# Altium schematic sheet Ethernet_Sheet2.SchDoc
size A3; SheetNumber: 3; SheetTotal: 3
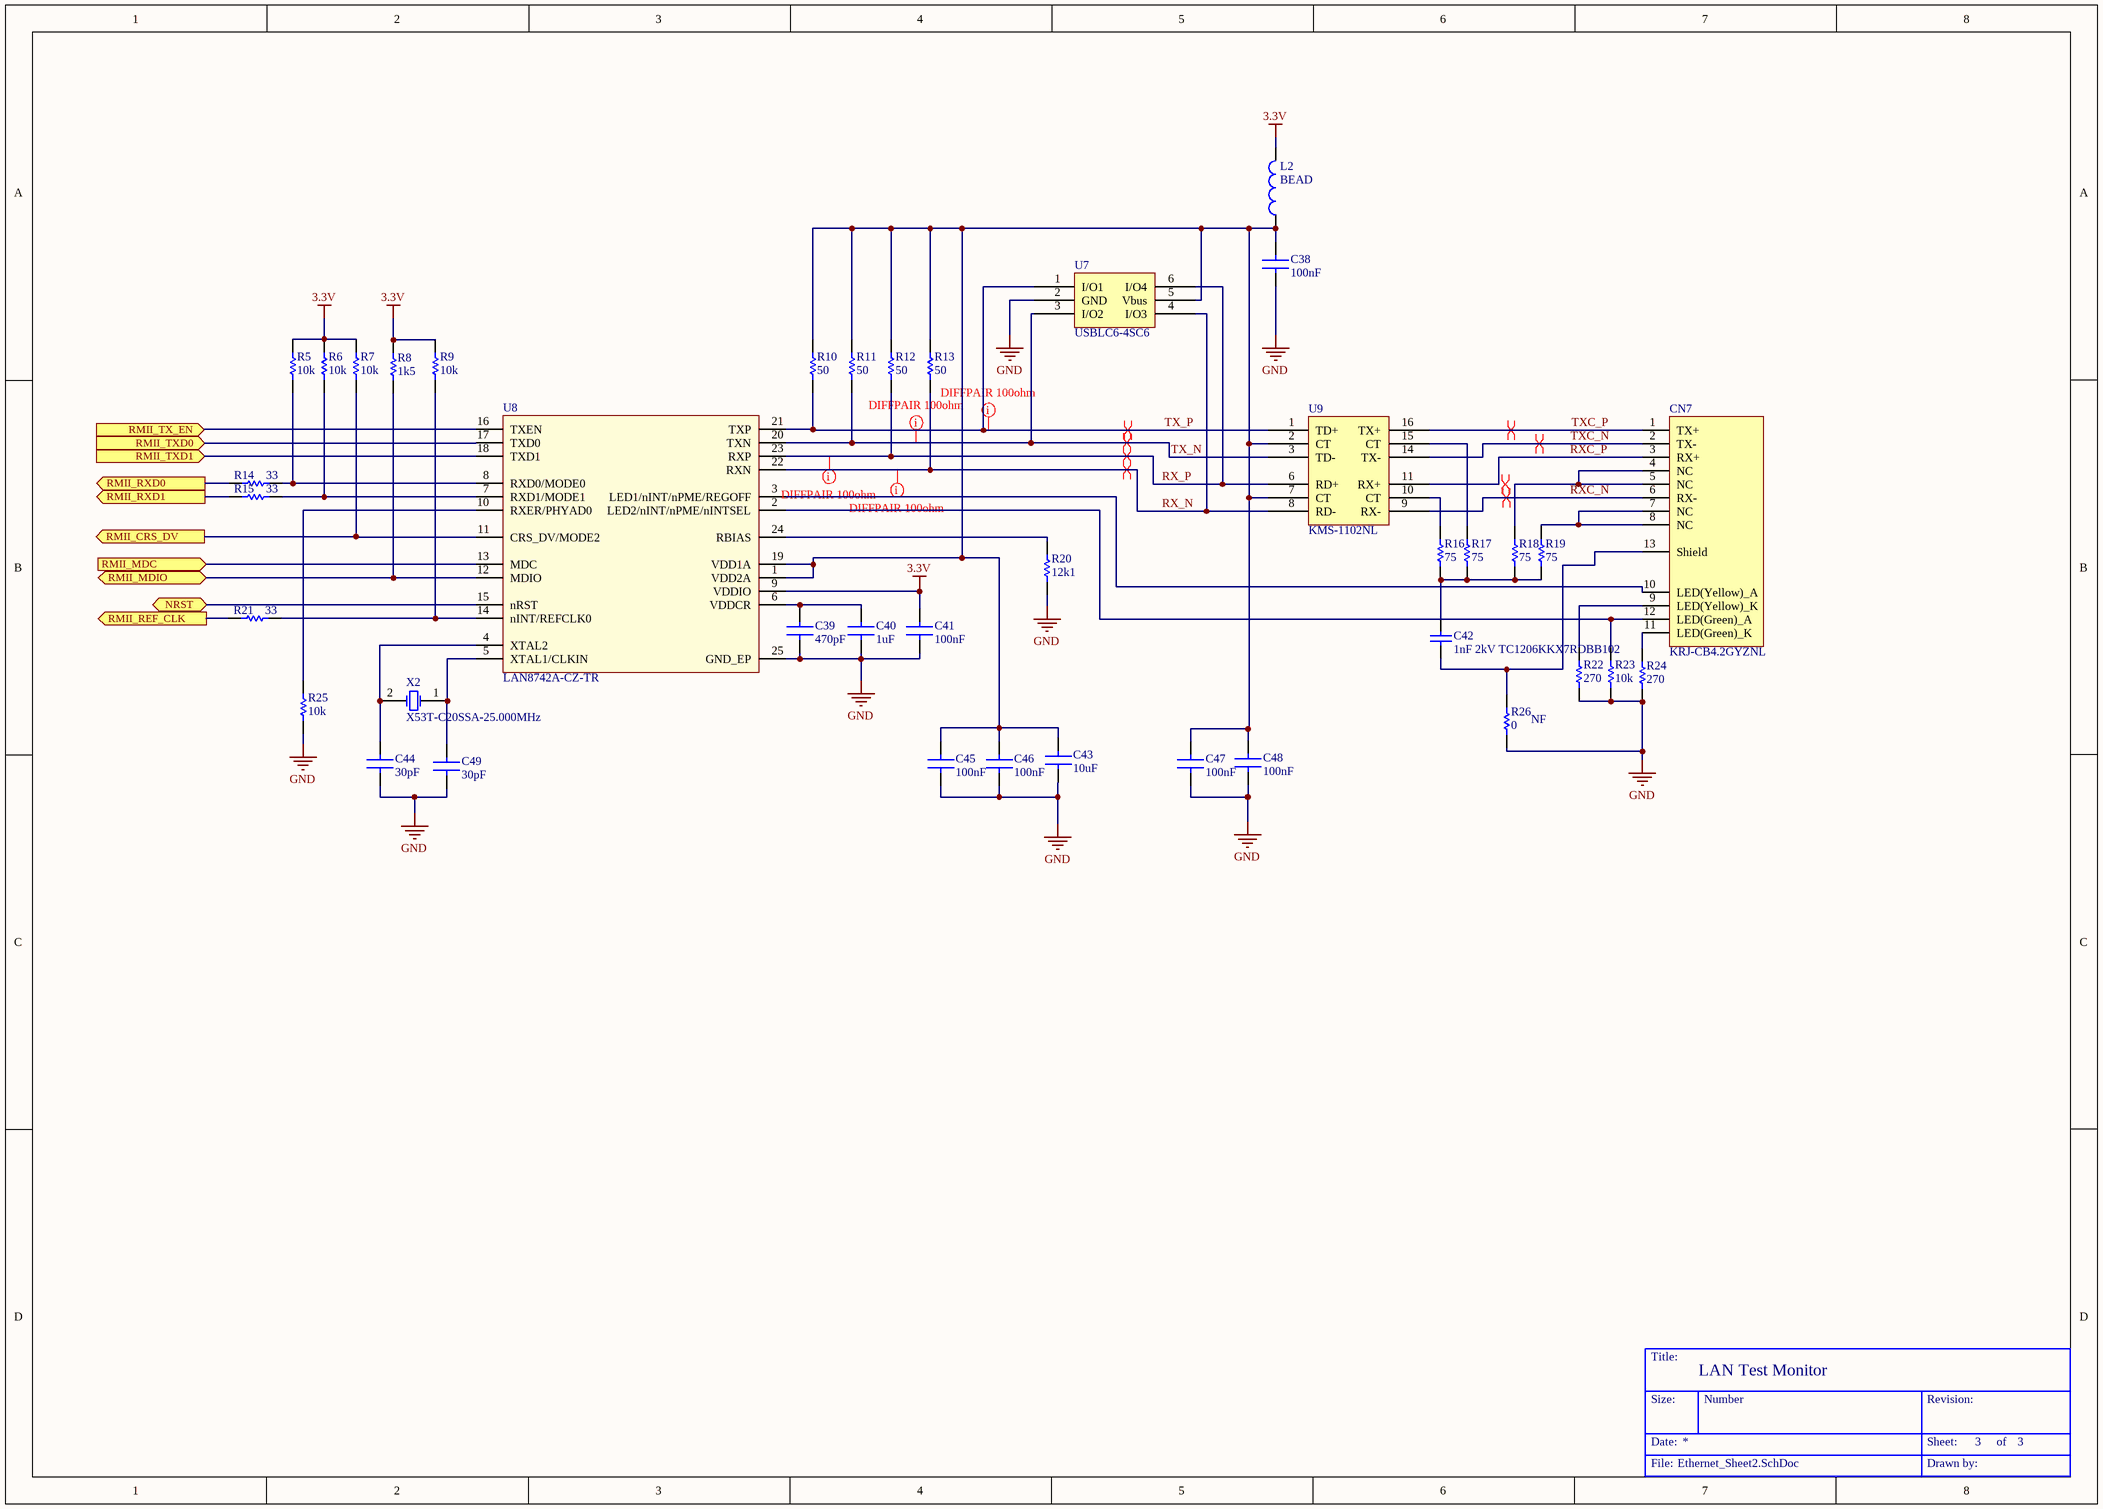
[diagram p0: Ethernet_Sheet2.SchDoc]

## Parts
*  Title Block  (value not drawn)  (graphical)
C38  100nF  [Cap_0603]
C39  470pF  [Cap_0603]
C40  1uF  [Cap_0603]
C41  100nF  [Cap_0603]
C42  1nF 2kV TC1206KKX7RDBB102  [CAP_1206]
C43  10uF  [Cap_0603]
C44  30pF  [Cap_0603]
C45  100nF  [Cap_0603]
C46  100nF  [Cap_0603]
C47  100nF  [Cap_0603]
C48  100nF  [Cap_0603]
C49  30pF  [Cap_0603]
CN7  KRJ-CB4.2GYZNL  [RJ45_KRJ-CB4.2GYZNL]
L2  BEAD  [Cap_0603]
R5  10k  [Res_0603]
R6  10k  [Res_0603]
R7  10k  [Res_0603]
R8  1k5  [Res_0603]
R9  10k  [Res_0603]
R10  50  [Res_0603]
R11  50  [Res_0603]
R12  50  [Res_0603]
R13  50  [Res_0603]
R14  33  [Res_0603]
R15  33  [Res_0603]
R16  75  [Res_0603]
R17  75  [Res_0603]
R18  75  [Res_0603]
R19  75  [Res_0603]
R20  12k1  [Res_0603]
R21  33  [Res_0603]
R22  270  [Res_0603]
R23  10k  [Res_0603]
R24  270  [Res_0603]
R25  10k  [Res_0603]
R26  0  [Res_0603]
U7  USBLC6-4SC6  [SOT23-6L]
U8  LAN8742A-CZ-TR  [QFN24_0R5_4X4]
U9  KMS-1102NL  [Trans. KMS-1102NL]
X2  X53T-C20SSA-25.000MHz  [XTAL_2SM_5R0X3R2]

## Ports
NRST (bidir), RMII_CRS_DV (out), RMII_MDC (in), RMII_MDIO (bidir), RMII_REF_CLK (out), RMII_RXD0 (out), RMII_RXD1 (out), RMII_TX_EN (in), RMII_TXD0 (in), RMII_TXD1 (in)

## Nets
3.3V: C41.2 L2.2 R5.2 R6.2 R7.2 R8.1 R9.2 U8.9(VDDIO)
GND: C38.1 C39.1 C40.1 C41.1 C43.1 C44.1 C45.1 C46.1 C47.1 C48.1 C49.1 R20.1 R22.1 R23.1 R24.1 R25.2 R26.1 U7.2(GND) U8.25(GND_EP)
NRST: U8.15(nRST) ; port NRST
RMII_CRS_DV: R7.1 U8.11(CRS_DV/MODE2) ; port RMII_CRS_DV
RMII_MDC: U8.13(MDC) ; port RMII_MDC
RMII_MDIO: R8.2 U8.12(MDIO) ; port RMII_MDIO
RMII_REF_CLK: R21.1 ; port RMII_REF_CLK
RMII_RXD0: R14.1 ; port RMII_RXD0
RMII_RXD1: R15.1 ; port RMII_RXD1
RMII_TX_EN: U8.16(TXEN) ; port RMII_TX_EN
RMII_TXD0: U8.17(TXD0) ; port RMII_TXD0
RMII_TXD1: U8.18(TXD1) ; port RMII_TXD1
RX_N: R13.1 U7.4(I/O3) U8.22(RXN) U9.8(RD-)
RX_P: R12.1 U7.6(I/O4) U8.23(RXP) U9.6(RD+)
RXC_N: CN7.6(RX-) U9.9(RX-)
RXC_P: CN7.3(RX+) U9.11(RX+)
TX_N: R11.1 U7.3(I/O2) U8.20(TXN) U9.3(TD-)
TX_P: R10.1 U7.1(I/O1) U8.21(TXP) U9.1(TD+)
TXC_N: CN7.2(TX-) U9.14(TX-)
TXC_P: CN7.1(TX+) U9.16(TX+)
NetC38_2: C38.2 C43.2 C45.2 C46.2 C47.2 C48.2 L2.1 R10.2 R11.2 R12.2 R13.2 U7.5(Vbus) U8.1(VDD2A) U8.19(VDD1A) U9.2(CT) U9.7(CT)
NetC39_2: C39.2 C40.2 U8.6(VDDCR)
NetC42_1: C42.1 CN7.13(Shield) R26.2
NetC42_2: C42.2 R16.1 R17.1 R18.1 R19.1
NetC44_2: C44.2 U8.4(XTAL2) X2.2(OSC2)
NetC49_2: C49.2 U8.5(XTAL1/CLKIN) X2.1(OSC1)
NetCN7_4: CN7.4(NC) CN7.5(NC) R18.2
NetCN7_7: CN7.7(NC) CN7.8(NC) R19.2
NetCN7_9: CN7.9(LED(Yellow)_K) R22.2
NetCN7_10: CN7.10(LED(Yellow)_A) U8.3(LED1/nINT/nPME/REGOFF)
NetCN7_11: CN7.11(LED(Green)_K) R24.2
NetCN7_12: CN7.12(LED(Green)_A) R23.2 U8.2(LED2/nINT/nPME/nINTSEL)
NetR5_1: R5.1 R14.2 U8.8(RXD0/MODE0)
NetR6_1: R6.1 R15.2 U8.7(RXD1/MODE1)
NetR9_1: R9.1 R21.2 U8.14(nINT/REFCLK0)
NetR16_2: R16.2 U9.10(CT)
NetR17_2: R17.2 U9.15(CT)
NetR20_2: R20.2 U8.24(RBIAS)
NetR25_1: R25.1 U8.10(RXER/PHYAD0)

## Layout directives
differential pair; rule Matched Net Lengths [Tolerance = 1mm]: RX_N, RX_P, RXC_N, RXC_P, TX_N, TX_P, TXC_N, TXC_P
mark named DIFFPAIR 100ohm: RX_N, RX_P, TX_N, TX_P

## Notes on the sheet
- (near R26) NF
- (in symbol Title Block) Title:; LAN Test Monitor; Size:; Number; Revision:; Date:; Sheet:; of; File:; Drawn by:

## Library data of the parts
C38 C41 C45-C48 = Cap 100nF 0603 10%
C39 = Cap 470pF 0603 10%
C40 = Cap 1uF 0603 10%
C42 = Cap 1nF 2kV: Capacitor 1nF 2kV; Value: 100nF; Revision: July-2002: Re-released for DXP Platform.
C43 = Cap 10uF 0603 10%
C44 C49 = Cap 30 pF 0603
CN7 = KRJ-CB4.2GYZNL: 100 Base-TX (Fast Ethernet) SMD RJ45 single port (1x1) with LEDS Integrated Magnetics Connector; Manuf_1: HanRun; Manuf_Part_1: HR961160C; Manuf_2: Pulse Electronics Corporation; Manuf_Part_2: J3011G21DNLT; Manuf_3: K.O.D International Holding; Manuf_Part_3: RMT-119A-12F6-GY-04; Distrib: Sub Co; Order: *
L2 = Inductor: Value: 100uH; Published: 8-Jun-2000; Revision: July-2002: Re-released for DXP Platform.; Publisher: Altium Limited
R5-R7 R9 R23 R25 = Res 10k 1% 0603: Manuf_Part_1: MCT 0603-50 1% P5 12K1; Manuf_1: VISHAY; Value: 12K1; Order: 2325243; ECCN_US/EU: n/a; Distrib: FARNELL
R8 = Res 1k5 1% 0603: Manuf_Part_1: MCT 0603-50 1% P5 12K1; Manuf_1: VISHAY; Value: 12K1; Order: 2325243; ECCN_US/EU: n/a; Distrib: FARNELL
R10-R13 = Res 50 1% 0603: Manuf_Part_1: MCT 0603-50 1% P5 12K1; Manuf_1: VISHAY; Value: 12K1; Order: 2325243; ECCN_US/EU: n/a; Distrib: FARNELL
R14 R15 R21 = Res 33 1% 0603: Manuf_Part_1: MCT 0603-50 1% P5 12K1; Manuf_1: VISHAY; Value: 12K1; Order: 2325243; ECCN_US/EU: n/a; Distrib: FARNELL
R16-R19 = Res 75 1% 0603: Manuf_Part_1: MCT 0603-50 1% P5 12K1; Manuf_1: VISHAY; Value: 12K1; Order: 2325243; ECCN_US/EU: n/a; Distrib: FARNELL
R20 = Res 12k1 1% 0603: Manuf_Part_1: MCT 0603-50 1% P5 12K1; Manuf_1: VISHAY; Order: 2325243; Value: 12K1; ECCN_US/EU: n/a; Distrib: FARNELL
R22 R24 = Res 270 1% 0603: Manuf_Part_1: MCT 0603-50 1% P5 12K1; Manuf_1: VISHAY; Value: 12K1; Order: 2325243; ECCN_US/EU: n/a; Distrib: FARNELL
R26 = Res 0 1% 0603: Manuf_Part_1: MCT 0603-50 1% P5 12K1; Manuf_1: VISHAY; Value: 12K1; Order: 2325243; ECCN_US/EU: n/a; Distrib: FARNELL
U8 = LAN8742A-CZ-TR: LAN8742A-CZ-TR - Small Footprint RMII 10/100 Ethernet, Transceiver with HP Auto-MDIX and flexPWR Technology SQFN-24; Manuf_1: MICROCHIP; Order: LAN8742A-CZ-TR; Manuf_Part_1: LAN8742A-CZ-TR; Distrib: MICROCHIP
U9 = KMS-1102NL_1
X2 = X53T-C20SSA-25.000MHz: Crystal Oscillator 25M; Published: 8-Jun-2000; LatestRevisionDate: 17-Jul-2002; LatestRevisionNote: Re-released for DXP Platform.; PackageReference: R38; Publisher: Altium Limited